# EAGLE design SpiCurrent-New (EAGLE 7.2.0)
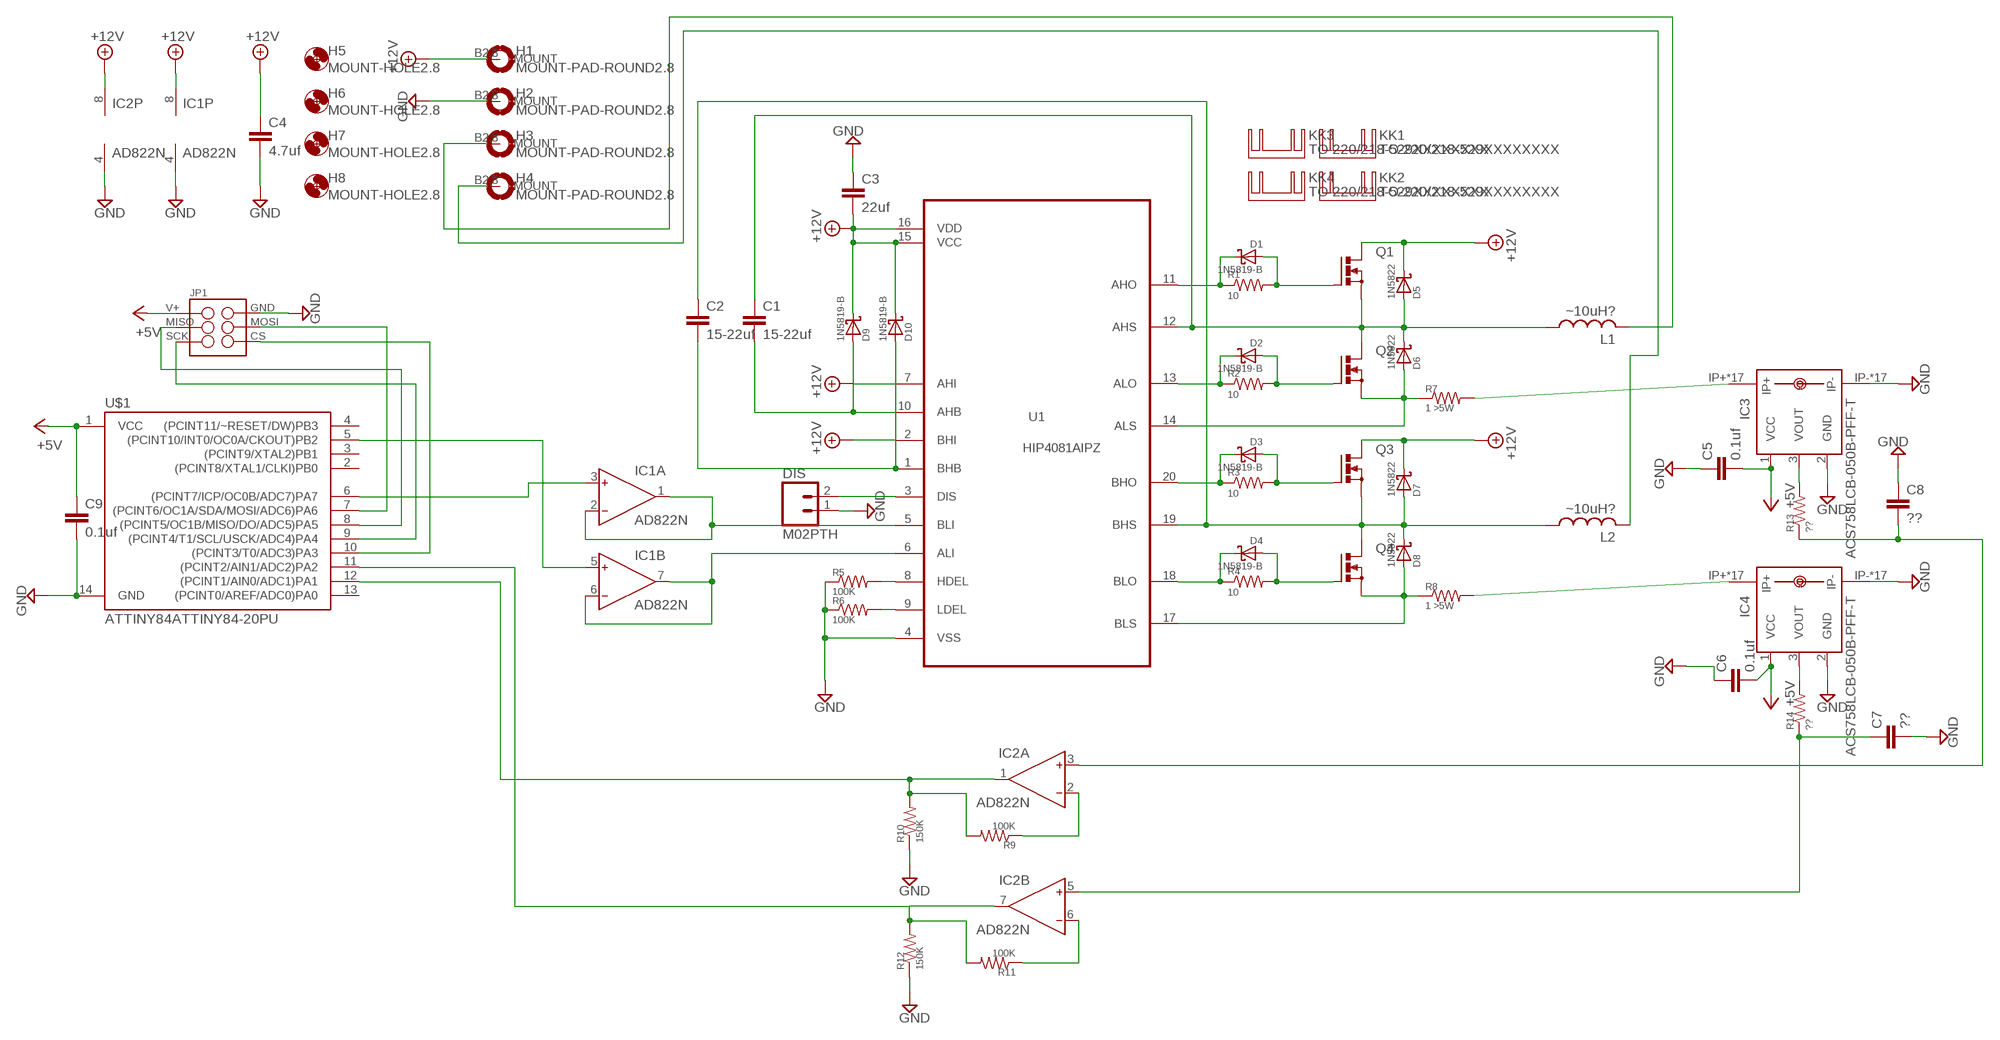
[diagram p0: schematic, sheet 1]

## Parts
C1  15-22uf  C-EU050-055X075  [C050-055X075]
C2  15-22uf  C-EU050-055X075  [C050-055X075]
C3  22uf  C-EU050-055X075  [C050-055X075]
C4  4.7uf  C-EU050-055X075  [C050-055X075]
C5  0.1uf  C-EU050-055X075  [C050-055X075]
C6  0.1uf  C-EU050-055X075  [C050-055X075]
C7  ??  C-EU050-055X075  [C050-055X075]
C8  ??  C-EU050-055X075  [C050-055X075]
C9  0.1uf  C-EU050-055X075  [C050-055X075]
D1  1N5819-B  [DO41-7.6]
D2  1N5819-B  [DO41-7.6]
D3  1N5819-B  [DO41-7.6]
D4  1N5819-B  [DO41-7.6]
D5  1N5822  1N5819-B  [DO41-7.6]
D6  1N5822  1N5819-B  [DO41-7.6]
D7  1N5822  1N5819-B  [DO41-7.6]
D8  1N5822  1N5819-B  [DO41-7.6]
D9  1N5819-B  [DO41-7.6]
D10  1N5819-B  [DO41-7.6]
DIS  M02PTH  [1X02]
H1  MOUNT-PAD-ROUND2.8  [2,8-PAD]
H2  MOUNT-PAD-ROUND2.8  [2,8-PAD]
H3  MOUNT-PAD-ROUND2.8  [2,8-PAD]
H4  MOUNT-PAD-ROUND2.8  [2,8-PAD]
H5  MOUNT-HOLE2.8  [2,8]
H6  MOUNT-HOLE2.8  [2,8]
H7  MOUNT-HOLE2.8  [2,8]
H8  MOUNT-HOLE2.8  [2,8]
IC1  AD822N  [DIL08]
IC2  AD822N  [DIL08]
IC3  ACS758LCB-050B-PFF-T  [CB-PFF]
IC4  ACS758LCB-050B-PFF-T  [CB-PFF]
JP1  M03X2SHROUD  [2X3-SPI-SHROUDED]
KK1  TO-220/218-529XXXXXXXX  [529XXXXXXXX]
KK2  TO-220/218-529XXXXXXXX  [529XXXXXXXX]
KK3  TO-220/218-529XXXXXXXX  [529XXXXXXXX]
KK4  TO-220/218-529XXXXXXXX  [529XXXXXXXX]
L1  ~10uH?  L-USTJ6-U2  [TJ6-U2]
L2  ~10uH?  L-USTJ6-U2  [TJ6-U2]
Q1  PMOSFET_NTO220BV  [TO220BV]
Q2  PMOSFET_NTO220BV  [TO220BV]
Q3  PMOSFET_NTO220BV  [TO220BV]
Q4  PMOSFET_NTO220BV  [TO220BV]
R1  10  R-US_0207/10  [0207/10]
R2  10  R-US_0207/10  [0207/10]
R3  10  R-US_0207/10  [0207/10]
R4  10  R-US_0207/10  [0207/10]
R5  100K  R-US_0207/10  [0207/10]
R6  100K  R-US_0207/10  [0207/10]
R7  1 >5W  R-US_VTA54  [VTA54]
R8  1 >5W  R-US_VTA54  [VTA54]
R9  100K  R-US_0207/10  [0207/10]
R10  150K  R-US_0207/10  [0207/10]
R11  100K  R-US_0207/10  [0207/10]
R12  150K  R-US_0207/10  [0207/10]
R13  ??  R-US_0207/10  [0207/10]
R14  ??  R-US_0207/10  [0207/10]
U1  HIP4081AIPZ  [DIP254P762X533-20]
U$1  ATTINY84ATTINY84-20PU  [DIL14]

## Nets
+5V: C5.2 C6.2 C9.1 IC3.1(VCC) IC4.1(VCC) JP1.1 U$1.1(VCC)
+12V: C3.2 C4.1 D5.C D7.C D9.C D10.C H1.B2,8(MOUNT) IC1.8(P:V+) IC2.8(P:V+) Q1.D Q3.D U1.2(BHI) U1.7(AHI) U1.15(VCC) U1.16(VDD)
GND: C3.1 C4.2 C5.1 C6.1 C7.2 C8.1 C9.2 DIS.1 H2.B2,8(MOUNT) IC1.4(P:V-) IC2.4(P:V-) IC3.2(GND) IC3.IP- IC3.IP-@2(IP-) IC3.IP-@3(IP-) IC3.IP-@4(IP-) IC3.IP-@5(IP-) IC3.IP-@6(IP-) IC3.IP-@7(IP-) IC3.IP-@8(IP-) IC3.IP-@9(IP-) IC3.IP-@10(IP-) IC3.IP-@11(IP-) IC3.IP-@12(IP-) IC3.IP-@13(IP-) IC3.IP-@14(IP-) IC3.IP-@15(IP-) IC3.IP-@16(IP-) IC3.IP-@17(IP-) IC4.2(GND) IC4.IP- IC4.IP-@2(IP-) IC4.IP-@3(IP-) IC4.IP-@4(IP-) IC4.IP-@5(IP-) IC4.IP-@6(IP-) IC4.IP-@7(IP-) IC4.IP-@8(IP-) IC4.IP-@9(IP-) IC4.IP-@10(IP-) IC4.IP-@11(IP-) IC4.IP-@12(IP-) IC4.IP-@13(IP-) IC4.IP-@14(IP-) IC4.IP-@15(IP-) IC4.IP-@16(IP-) IC4.IP-@17(IP-) JP1.2 R5.1 R6.1 R10.1 R12.1 U1.4(VSS) U$1.14(GND)
N$1: IC1.1(A:OUT) IC1.2(A:IN-) U1.5(BLI)
N$2: IC1.6(B:IN-) IC1.7(B:OUT) U1.6(ALI)
N$3: D3.C R3.1 U1.20(BHO)
N$4: D3.A Q3.G R3.2
N$5: D4.C R4.1 U1.18(BLO)
N$6: D4.A Q4.G R4.2
N$7: D2.C R2.1 U1.13(ALO)
N$8: D2.A Q2.G R2.2
N$9: D1.C R1.1 U1.11(AHO)
N$10: D1.A Q1.G R1.2
N$11: C1.1 D5.A D6.C L1.1 Q1.S Q2.D U1.12(AHS)
N$12: R5.2 U1.8(HDEL)
N$13: R6.2 U1.9(LDEL)
N$14: C2.1 D7.A D8.C L2.1 Q3.S Q4.D U1.19(BHS)
N$15: D6.A Q2.S R7.1 U1.14(ALS)
N$16: D8.A Q4.S R8.1 U1.17(BLS)
N$17: C1.2 D9.A U1.10(AHB)
N$18: C2.2 D10.A U1.1(BHB)
N$19: DIS.2 U1.3(DIS)
N$20: JP1.4 U$1.7((PCINT6/OC1A/SDA/MOSI/ADC6)PA6)
N$21: JP1.3 U$1.8((PCINT5/OC1B/MISO/DO/ADC5)PA5)
N$22: JP1.5 U$1.9((PCINT4/T1/SCL/USCK/ADC4)PA4)
N$23: JP1.6 U$1.10((PCINT3/T0/ADC3)PA3)
N$24: IC1.5(B:IN+) U$1.5((PCINT10/INT0/OC0A/CKOUT)PB2)
N$25: IC1.3(A:IN+) U$1.6((PCINT7/ICP/OC0B/ADC7)PA7)
N$26: IC2.2(A:IN-) R9.1
N$27: IC4.IP+ IC4.IP+@2(IP+) IC4.IP+@3(IP+) IC4.IP+@4(IP+) IC4.IP+@5(IP+) IC4.IP+@6(IP+) IC4.IP+@7(IP+) IC4.IP+@8(IP+) IC4.IP+@9(IP+) IC4.IP+@10(IP+) IC4.IP+@11(IP+) IC4.IP+@12(IP+) IC4.IP+@13(IP+) IC4.IP+@14(IP+) IC4.IP+@15(IP+) IC4.IP+@16(IP+) IC4.IP+@17(IP+) R8.2
N$28: IC2.1(A:OUT) R9.2 R10.2 U$1.12((PCINT1/AIN0/ADC1)PA1)
N$29: IC2.7(B:OUT) R11.2 R12.2 U$1.11((PCINT2/AIN1/ADC2)PA2)
N$30: IC2.6(B:IN-) R11.1
N$31: IC3.IP+ IC3.IP+@2(IP+) IC3.IP+@3(IP+) IC3.IP+@4(IP+) IC3.IP+@5(IP+) IC3.IP+@6(IP+) IC3.IP+@7(IP+) IC3.IP+@8(IP+) IC3.IP+@9(IP+) IC3.IP+@10(IP+) IC3.IP+@11(IP+) IC3.IP+@12(IP+) IC3.IP+@13(IP+) IC3.IP+@14(IP+) IC3.IP+@15(IP+) IC3.IP+@16(IP+) IC3.IP+@17(IP+) R7.2
N$32: C8.2 IC2.3(A:IN+) R13.1
N$33: C7.1 IC2.5(B:IN+) R14.1
N$34: IC3.3(VOUT) R13.2
N$35: IC4.3(VOUT) R14.2
N$36: H3.B2,8(MOUNT) L1.2
N$37: H4.B2,8(MOUNT) L2.2
Unconnected: U$1.2((PCINT8/XTAL1/CLKI)PB0) U$1.3((PCINT9/XTAL2)PB1) U$1.4((PCINT11/~RESET/DW)PB3) U$1.13((PCINT0/AREF/ADC0)PA0)

## Library data of the parts
C1-C9 = rcl:C-EU: CAPACITOR, European symbol
D1-D10 = diode-custom:1N581*: 1.0A SCHOTTKY BARRIER RECTIFIER Source: http://www.diodes.com/datasheets/ds23001.pdf
DIS = SparkFun-Connectors:M02: Standard 2-pin 0.1" header. Use with - straight break away headers ( PRT-00116) - right angle break away headers (PRT-00553) - swiss pins (PRT-00743) - machine pins (PRT-00117) - female headers (PRT-00115) Molex polarized connector foot print use with: PRT-08233 with associated crimp pins and housings. 2.54_SCREWTERM for use with PRT-10571. 3.5mm Screw Terminal footprints for PRT-08084 5mm Screw Terminal footprints for use with PRT-08432
H1-H4 = holes-custom:MOUNT-PAD-ROUND: MOUNTING PAD, round
H5-H8 = holes:MOUNT-HOLE: MOUNTING HOLE with drill center marker
IC1 IC2 = analog-devices:AD822: Single-Supply, Rail-to-Rail Low Power FET-Input Op Amp Source: http://www.analog.com/static/imported-files/data_sheets/AD822.pdf; OC_FARNELL: 1438581; OC_NEWARK: unknown
IC3 IC4 = allegro:ACS758*: Thermally Enhanced, Fully Integrated, Hall Effect-Based Linear Current Sensor with 100 micro Ohm Current Conductor display layer 49 Reference in BRD and place VIAs on circles Source: http://www.allegromicro.com/en/Products/Part_Numbers/0758/0758.pdf; MPN: ACS758LCB-050B-PFF-T; OC_FARNELL: 1718997; OC_NEWARK: 04R7131
JP1 = CustomParts:M03X2: 2x3 .1" header. Shrouded, with keying- CONN-10681 SMT- CONN-11415 Pogo pins- HW-11044; PROD_ID: CONN-10681
KK1-KK4 = heatsink-aavid:TO-220/218: HEATSINKS TO-220/218
L1 L2 = rcl:L-US: INDUCTOR, American symbol
Q1-Q4 = transistor-power:PMOSFET_N: Power MOSFET N-Channel
R1-R4 = resistor:R-US_: RESISTOR, American symbol
R5-R14 = resistor-custom:R-US_: RESISTOR, American symbol
U1 = Intersil_By_element14_Batch_1:HIP4081AIPZ: Bridge FET Driver; MPN: HIP4081AIPZ; OC_FARNELL: 9664130; OC_NEWARK: 57K3817; PACKAGE: DIP-20; SUPPLIER: INTERSIL
U$1 = SparkFun-DigitalIC:ATTINY84: Atmel 14-pin 2/4/8kB flash uC

## Board
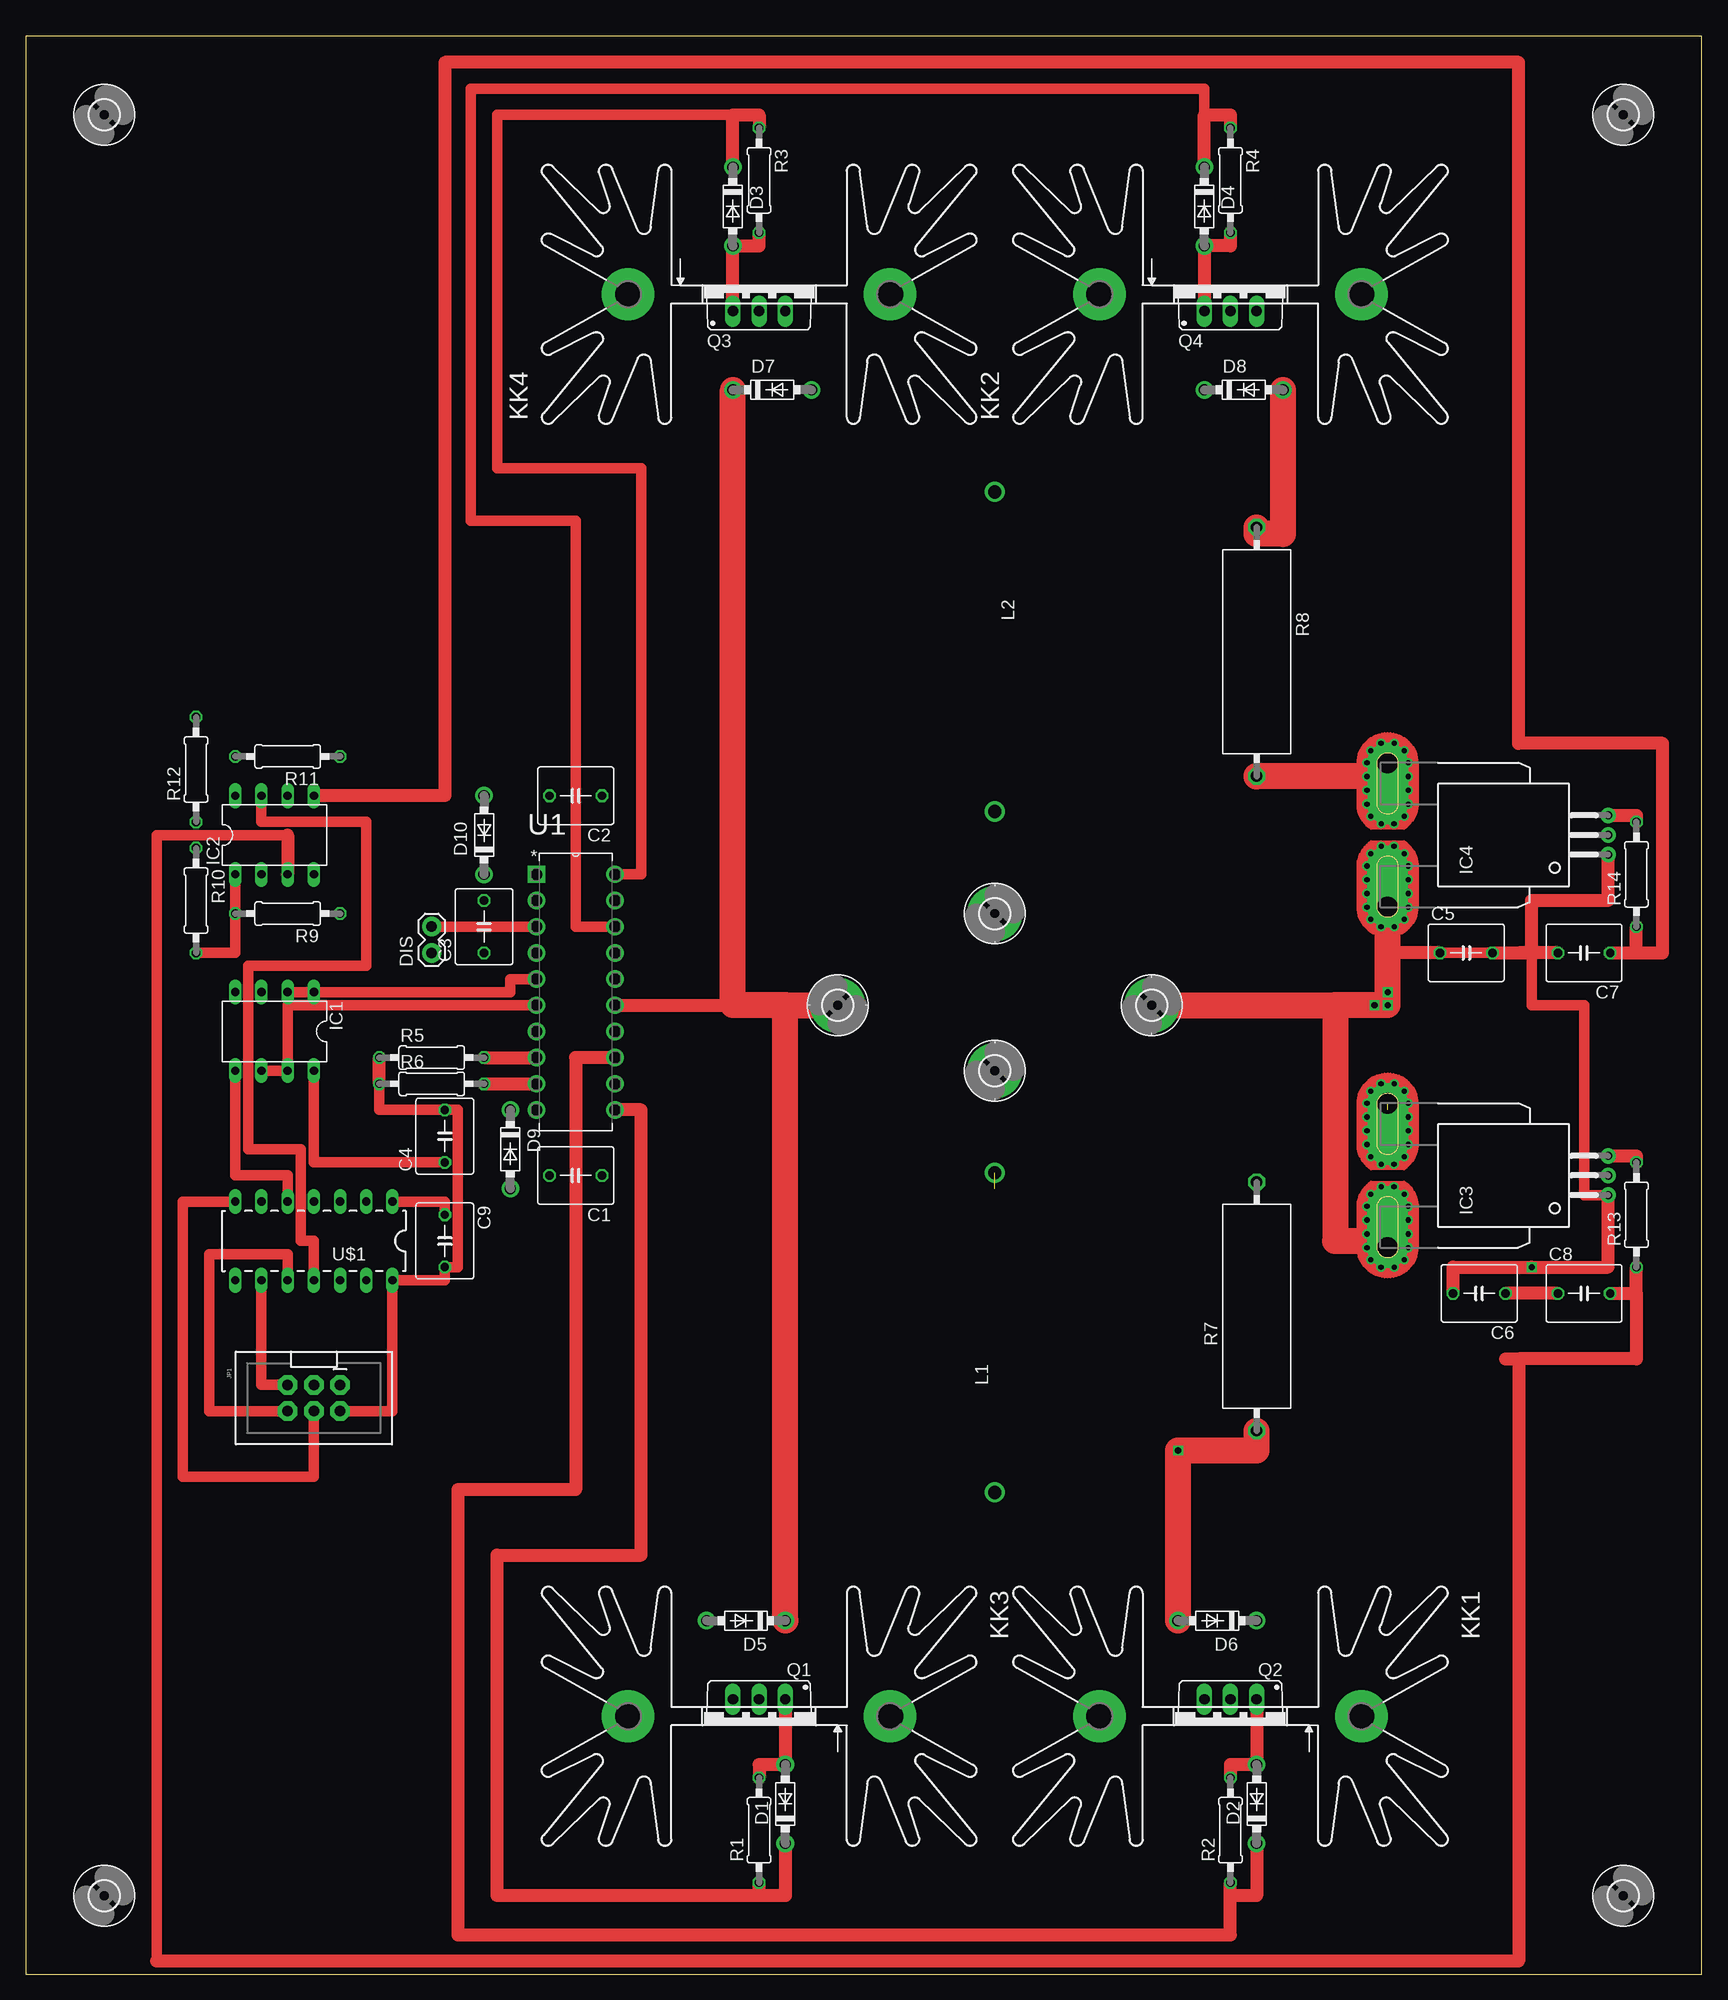
[diagram p1: board, top side]
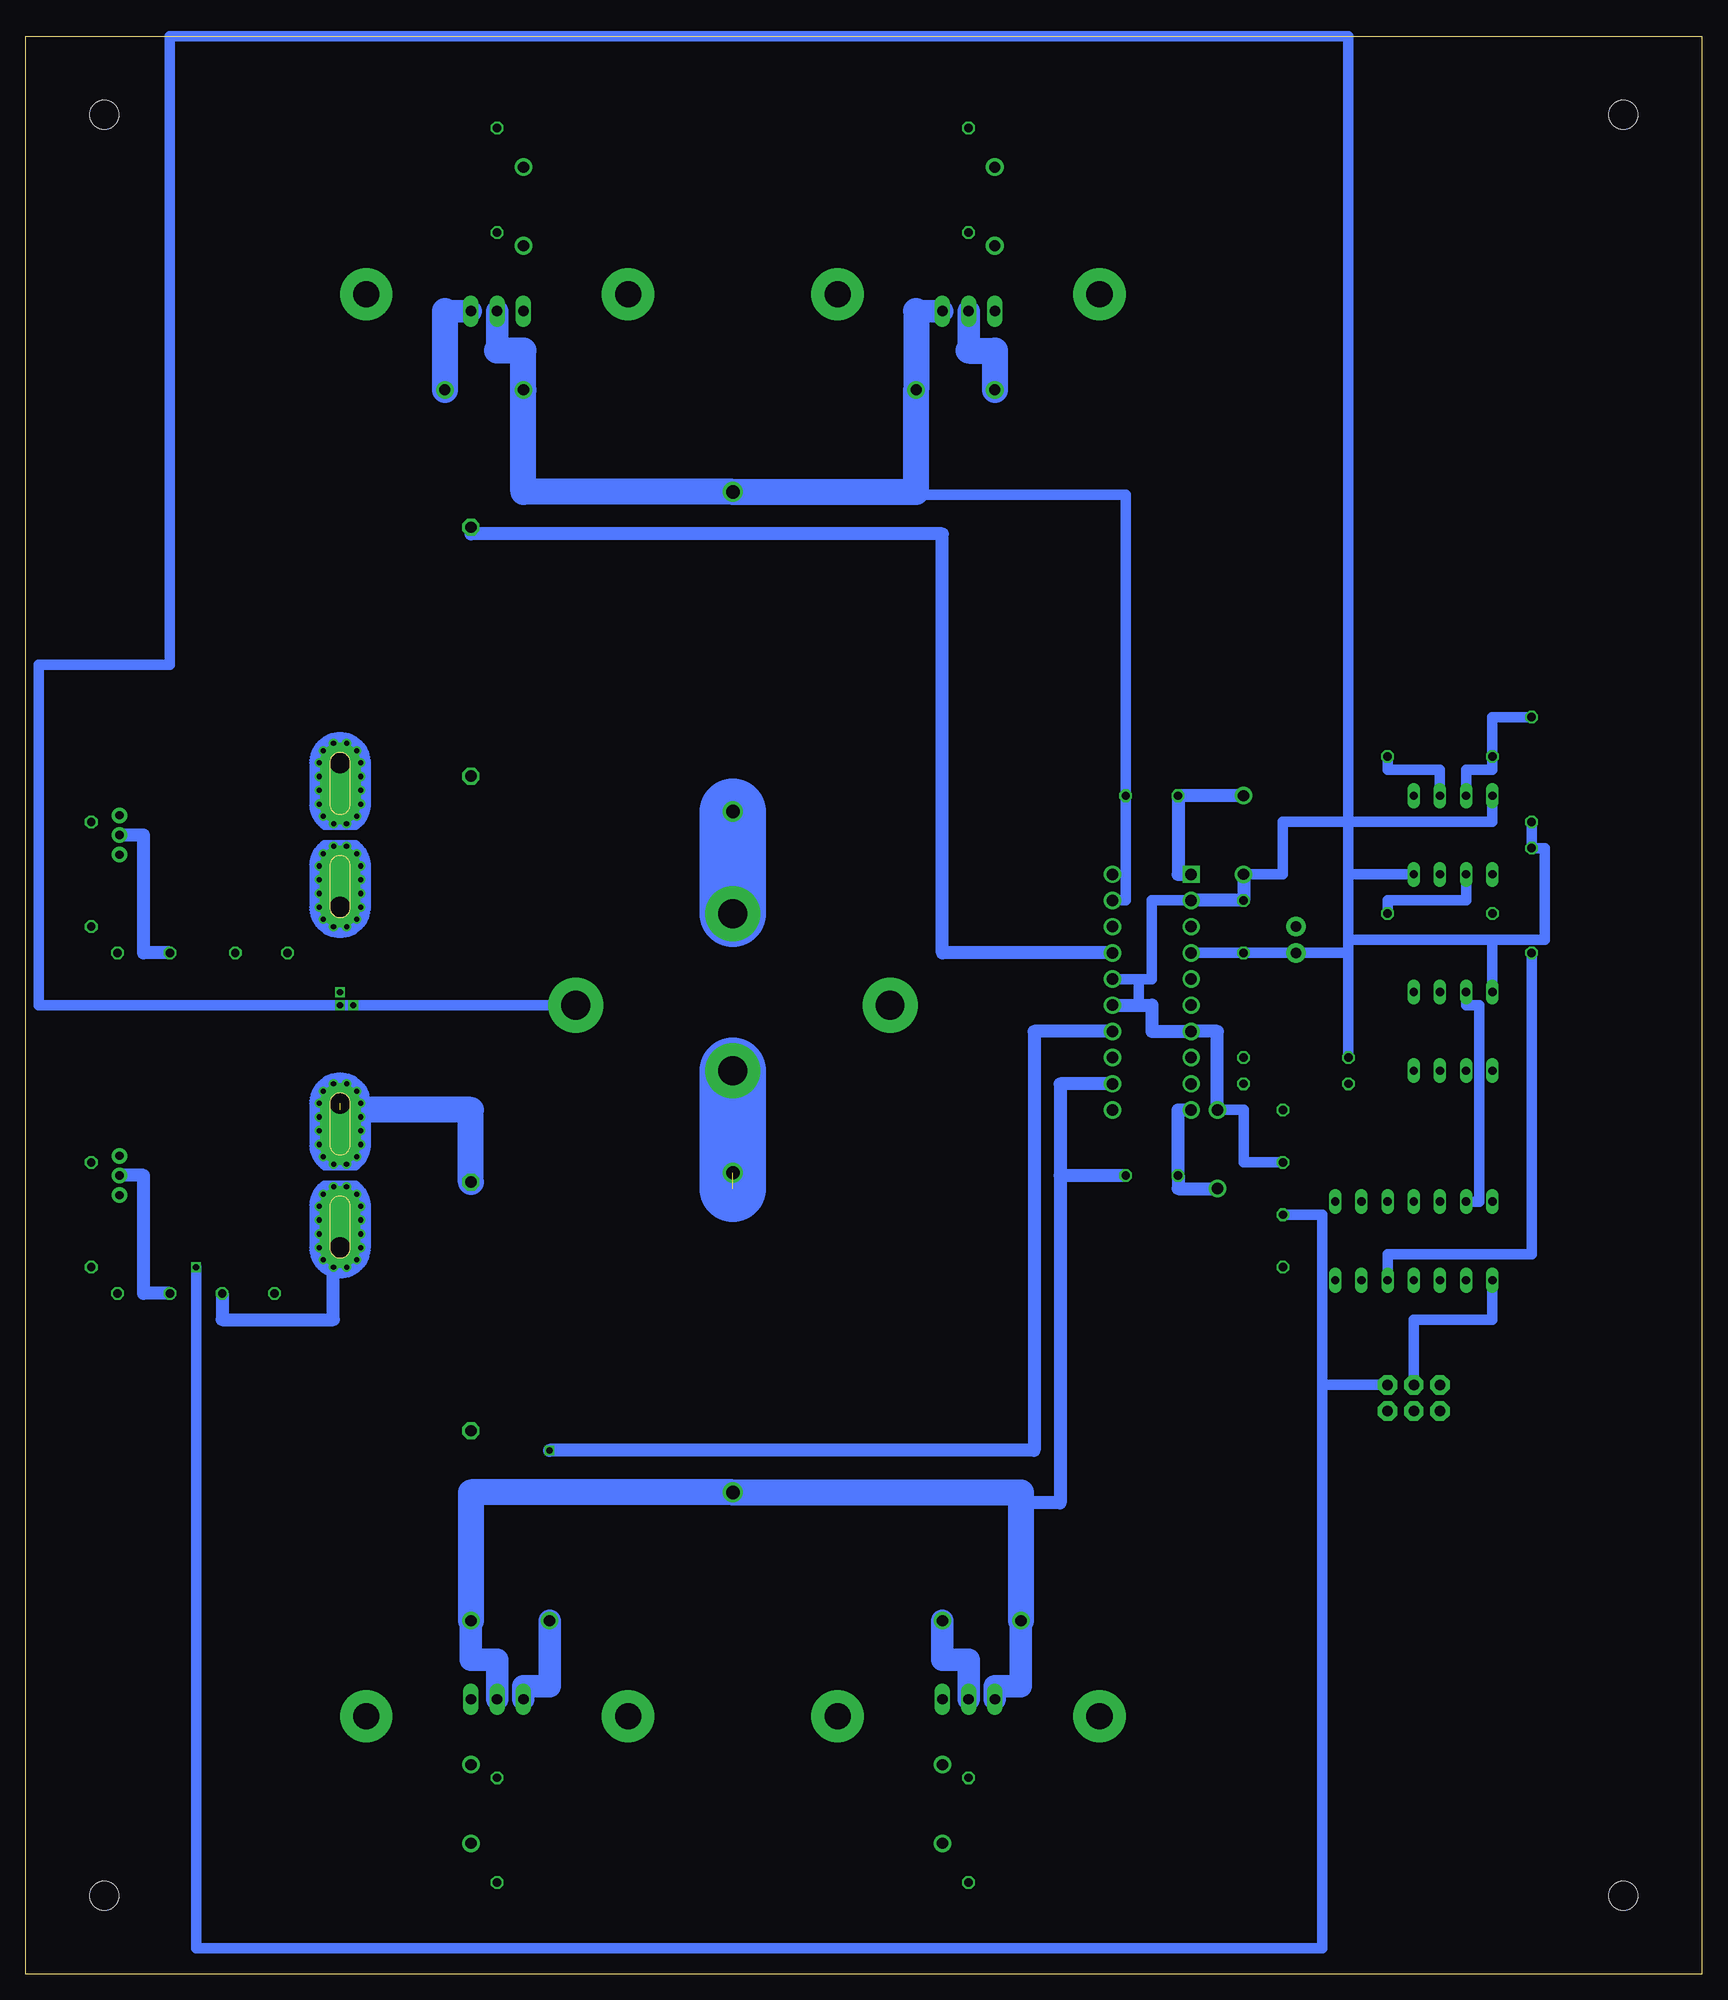
[diagram p2: board, bottom side, seen from below]

Size 162.56 x 187.96 mm. Coordinates in mm from the lower left corner, seen from the top.
Outline: 0,0 162.56,0 162.56,187.96 0,187.96 0,0
Copper layers (1*16): Top 0.0356mm / dielectric 1.5011mm / Bottom 0.0356mm
Design rules "LaenPCBOrder-bigtesting": minimum track width 10mil, minimum drill 13mil, track to track 10mil, track to pad 10mil, pad to pad 10mil, via to via 10mil, smd to smd 10mil, copper to edge 15mil, drill to drill 6mil, minimum pad ring 7mil, minimum via ring 7mil, stop-mask expansion 3mil, vias tented up to drill 0mil, thermal gap 20mil

### Footprints (pad centres in the part's own frame; a part is rotated, then mirrored left to right if it is on the bottom)
C050-055X075 = drill 0.813 octagon: 1 -2.54,0; 2 2.54,0
DO41-7.6 = drill 1.1 pad 1.7: A 3.81,0; C -3.81,0
1X02 = drill 1.016 pad 1.88: 1 0,0; 2 2.54,0
2,8-PAD = drill 2.8 pad 5.334: B2,8 0,0
2,8 = hole 2.8: 0,0
DIL08 = drill 0.813 long: 1 -3.81,-3.81; 2 -1.27,-3.81; 3 1.27,-3.81; 4 3.81,-3.81; 5 3.81,3.81; 6 1.27,3.81; 7 -1.27,3.81; 8 -3.81,3.81
CB-PFF = drill 0.8 pad 1.5: 1 -1.91,-21.4; 2 0,-21.4; 3 1.91,-21.4 | drill 2 pad 4 offset: IP+ 7,0; IP- -7,0 | drill 0.5 pad 0.9: IP+@2 8.89,0.635; IP+@3 8.89,-0.635; IP+@4 8.175,-1.625; IP+@5 7,-2; IP+@6 5.675,-2; IP+@7 4.35,-2; IP+@8 3,-2; IP+@9 1.825,-1.625; IP+@10 1.1,-0.625; IP+@11 1.1,0.625; IP+@12 1.825,1.625; IP+@13 3,2; IP+@14 4.35,2; IP+@15 5.675,2; IP+@16 7,2; IP+@17 8.175,1.625; IP-@2 -8.89,0.635; IP-@3 -8.89,-0.635; IP-@4 -8.175,-1.625; IP-@5 -7,-2; IP-@6 -5.675,-2; IP-@7 -4.325,-2; IP-@8 -3,-2; IP-@9 -1.825,-1.625; IP-@10 -1.1,-0.625; IP-@11 -1.1,0.625; IP-@12 -1.825,1.625; IP-@13 -3,2; IP-@14 -4.325,2; IP-@15 -5.675,2; IP-@16 -7,2; IP-@17 -8.175,1.625
2X3-SPI-SHROUDED = drill 1.016 pad 1.88 octagon: 1 -1.27,2.54; 2 1.27,2.54; 3 -1.27,0; 4 1.27,0; 5 -1.27,-2.54; 6 1.27,-2.54
529XXXXXXXX = drill 2.54 pad 5.08: A2,5 -12.7,-0.889; B2,5 12.7,-0.889
TJ6-U2 = drill 1.3: 1 -15.5,0; 2 15.5,0
TO220BV = drill 1.016 long: D 0,-2.54; G -2.54,-2.54; S 2.54,-2.54
0207/10 = drill 0.813 octagon: 1 -5.08,0; 2 5.08,0
VTA54 = drill 1.1 octagon: 1 -12.065,0; 2 12.065,0
DIP254P762X533-20 = drill 1.118 square: 1 -7.62,22.86 | drill 1.118: 2 -7.62,20.32; 3 -7.62,17.78; 4 -7.62,15.24; 5 -7.62,12.7; 6 -7.62,10.16; 7 -7.62,7.62; 8 -7.62,5.08; 9 -7.62,2.54; 10 -7.62,0; 11 0,0; 12 0,2.54; 13 0,5.08; 14 0,7.62; 15 0,10.16; 16 0,12.7; 17 0,15.24; 18 0,17.78; 19 0,20.32; 20 0,22.86
DIL14 = drill 0.813 long: 1 -8.89,-3.81; 2 -6.35,-3.81; 3 -3.81,-3.81; 4 -1.27,-3.81; 5 1.27,-3.81; 6 3.81,-3.81; 7 6.35,-3.81; 8 6.35,3.81; 9 3.81,3.81; 10 1.27,3.81; 11 -1.27,3.81; 12 -3.81,3.81; 13 -6.35,3.81; 14 -8.89,3.81

### Placement (x,y rotation side)
C1  53.34,77.47 180 top
C2  53.34,114.3 180 top
C3  44.45,101.6 90 top
C4  40.64,81.28 90 top
C5  139.7,99.06 0 top
C6  140.97,66.04 180 top
C7  151.13,99.06 180 top
C8  151.13,66.04 0 top
C9  40.64,71.12 270 top
D1  73.66,16.51 90 top
D2  119.38,16.51 90 top
D3  68.58,171.45 270 top
D4  114.3,171.45 270 top
D5  69.85,34.29 180 top
D6  115.57,34.29 180 top
D7  72.39,153.67 0 top
D8  118.11,153.67 0 top
D9  46.99,80.01 270 top
D10  44.45,110.49 90 top
DIS  39.37,99.06 90 top
H1  78.74,93.98 270 top
H2  109.22,93.98 180 top
H3  93.98,87.63 0 top
H4  93.98,102.87 0 top
H5  7.62,7.62 0 top
H6  154.94,180.34 0 top
H7  154.94,7.62 0 top
H8  7.62,180.34 0 top
IC1  24.13,91.44 180 top
IC2  24.13,110.49 0 top
IC3  132.08,77.47 90 top
IC4  132.08,110.49 90 top
JP1  27.94,55.88 270 top
KK1  116.84,24.13 180 top
KK2  116.84,163.83 0 top
KK3  71.12,24.13 180 top
KK4  71.12,163.83 0 top
L1  93.98,62.23 90 top
L2  93.98,128.27 270 top
Q1  71.12,24.13 180 top
Q2  116.84,24.13 180 top
Q3  71.12,163.83 0 top
Q4  116.84,163.83 0 top
R1  71.12,13.97 90 top
R2  116.84,13.97 90 top
R3  71.12,173.99 270 top
R4  116.84,173.99 270 top
R5  39.37,88.9 0 top
R6  39.37,86.36 0 top
R7  119.38,64.77 90 top
R8  119.38,128.27 270 top
R9  25.4,102.87 180 top
R10  16.51,104.14 270 top
R11  25.4,118.11 180 top
R12  16.51,116.84 90 top
R13  156.21,73.66 90 top
R14  156.21,106.68 90 top
U1  57.15,83.82 0 top
U$1  26.67,71.12 180 top

### Tracks (layer width: path | path; a pad name or v marks a point on that pad's centre or on a via)
+5V  (via drill 0.6)
  Top 1.016: C9.1 40.64,74.93 U$1.1 | IC3.1 151.13,75.56 151.13,93.98 146.05,93.98 146.05,99.06
  Top 1.27: C5.2 146.05,99.06 146.05,104.14 153.48,104.14 IC4.1 | C6.2 138.43,68.58 v146.05,68.58 153.48,68.58 IC3.1
  Bottom 1.016: v146.05,68.58 146.05,2.54 36.83,2.54 36.83,57.15 | 36.83,57.15 JP1.1 | 36.83,57.15 36.83,73.66 C9.1
+12V
  Top 1.016: C4.1 27.94,78.74 IC1.8
  Top 1.27: U1.15 68.58,93.98
  Top 2.54: D5.C 73.66,93.98 | 73.66,93.98 H1.B2,8 | 73.66,93.98 68.58,93.98 D7.C
  Bottom 1.016: C4.1 44.45,78.74 44.45,83.82 D9.C | U1.2 53.34,104.14 53.34,96.52 U1.16 54.61,96.52 54.61,93.98 | IC2.8 20.32,111.76 40.64,111.76 40.64,106.68 D10.C
  Bottom 1.27: U1.15 54.61,93.98 53.34,93.98 53.34,91.44 U1.7 46.99,91.44 D9.C | U1.2 C3.2 D10.C
  Bottom 2.184: Q3.D 71.12,157.48 | Q1.D 71.12,30.48 73.66,30.48 D5.C
  Bottom 2.54: 71.12,157.48 68.58,157.48 D7.C
GND  (via drill 0.6)
  Top 1.016: R6.1 34.29,83.82 C4.2 41.91,83.82 41.91,68.58 C9.2 40.64,67.31 U$1.14 35.56,54.61 JP1.2 | C5.1 144.78,99.06
  Top 1.27: C5.1 132.08,99.06 | C7.2 144.78,99.06 | C8.1 C6.1 | R6.1 R5.1
  Top 2.54: H2.B2,8 127,93.98 | IC4.IP- 132.08,99.06 v132.08,95.25 v132.08,93.98 v130.81,93.98 127,93.98 | 127,93.98 127,71.12 132.08,71.12 IC3.IP-
  Bottom 1.016: R5.1 34.29,99.06 | 34.29,99.06 DIS.1 C3.1 U1.4 | H2.B2,8 161.29,93.98 161.29,127 148.59,127 148.59,187.96 34.29,187.96 34.29,106.68 | 34.29,106.68 34.29,100.33 | 34.29,100.33 34.29,99.06 | IC2.4 34.29,106.68 | R12.1 R10.1 15.24,109.22 15.24,100.33 20.32,100.33 | IC1.4 20.32,100.33 | 20.32,100.33 34.29,100.33
  Bottom 1.27: C7.2 151.13,99.06 151.13,110.49 IC4.2 | C8.1 151.13,66.04 151.13,77.47 IC3.2 | C6.1 143.51,63.5 132.72,63.5 IC3.IP-@3
N$1
  Top 1.016: IC1.2 IC1.1 46.99,95.25 46.99,96.52 U1.5
N$2
  Top 1.016: U1.6 25.4,93.98 IC1.7 IC1.6
N$3
  Top 1.016: U1.20 59.69,106.68 59.69,146.05 45.72,146.05 45.72,180.34 68.58,180.34
  Top 1.27: D3.C 68.58,180.34 71.12,180.34 R3.1
N$4
  Top 1.27: Q3.G D3.A 71.12,167.64 R3.2
N$5
  Top 1.016: U1.18 53.34,101.6 53.34,140.97 43.18,140.97 43.18,182.88 114.3,182.88 114.3,180.34
  Top 1.27: D4.C 114.3,180.34 116.84,180.34 R4.1
N$6
  Top 1.27: Q4.G D4.A 116.84,167.64 R4.2
N$7
  Top 1.27: D2.C 119.38,7.62 116.84,7.62 R2.1 116.84,3.81 41.91,3.81 41.91,46.99 53.34,46.99 53.34,88.9 U1.13
N$8
  Top 1.27: Q2.G D2.A 116.84,20.32 R2.2
N$9
  Top 1.27: 71.12,7.62 73.66,7.62 D1.C | 71.12,7.62 R1.1 | 71.12,7.62 45.72,7.62 45.72,40.64 59.69,40.64 59.69,83.82 U1.11
N$10
  Top 1.27: Q1.G D1.A 71.12,20.32 R1.2
N$11
  Bottom 1.27: U1.12 62.23,86.36 62.23,77.47 | 62.23,77.47 C1.1 | 62.23,77.47 62.23,45.72 66.04,45.72
  Bottom 2.184: D5.A 66.04,27.94 68.58,27.94 Q1.S | Q2.D 116.84,30.48 119.38,30.48 D6.C
  Bottom 2.54: D6.C 119.38,46.73 L1.1 66.04,46.73 66.04,45.72 D5.A
N$12
  Top 1.27: R5.2 U1.8
N$13
  Top 1.27: R6.2 U1.9
N$14
  Bottom 1.016: U1.19 55.88,104.14 C2.1 55.88,143.51 76.2,143.51 76.2,143.77
  Bottom 2.184: 116.84,157.48 Q4.D | Q3.S 76.2,161.29
  Bottom 2.54: 116.84,157.48 114.3,157.48 D8.C 114.3,143.77 L2.1 76.2,143.77 D7.A 76.2,161.29
N$15  (via drill 0.6)
  Top 2.54: D6.A v111.76,50.8 119.38,50.8 R7.1
  Bottom 1.27: U1.14 64.77,91.44 64.77,50.8 v111.76,50.8
  Bottom 2.184: Q2.S 114.3,27.94 111.76,27.94 D6.A
N$16  (1 unrouted)
  Top 2.54: D8.A 121.92,139.7 119.38,139.7 R8.1
  Bottom 1.27: U1.17 73.66,99.06 73.66,139.7 119.38,139.7
  Bottom 2.184: Q4.S 121.92,161.29
  Bottom 2.54: 121.92,161.29 D8.A
N$17
  Bottom 1.27: U1.10 50.8,83.82 C1.2 50.8,76.2 D9.A
N$18
  Bottom 1.27: U1.1 50.8,106.68 C2.2 D10.A
N$19
  Top 1.016: DIS.2 U1.3
N$20
  Top 1.016: JP1.4 27.94,48.26 15.24,48.26 15.24,74.93 U$1.7
N$21
  Bottom 1.016: JP1.3 27.94,63.5 20.32,63.5 U$1.8
N$22
  Top 1.016: JP1.5 22.86,57.15 U$1.9
N$23
  Top 1.016: JP1.6 17.78,54.61 17.78,69.85 25.4,69.85 U$1.10
N$24
  Top 1.016: U$1.5 25.4,77.47 20.32,77.47 IC1.5
N$25
  Bottom 1.016: U$1.6 21.59,74.93 21.59,93.98 22.86,93.98 IC1.3
N$26
  Bottom 1.016: IC2.2 22.86,104.14 30.48,104.14 R9.1
N$27
  Top 2.54: IC4.IP+@15 119.38,116.16 R8.2
N$28
  Top 1.016: IC2.1 R9.2 20.32,99.06 R10.2
  Bottom 1.016: U$1.12 30.48,69.85 16.51,69.85 R10.2
N$29
  Top 1.016: U$1.11 27.94,71.12 26.67,71.12 26.67,80.01 21.59,80.01 21.59,97.79 33.02,97.79 33.02,111.76 22.86,111.76 IC2.7
  Bottom 1.016: R12.2 20.32,121.92 R11.2 20.32,116.84 22.86,116.84 IC2.7
N$30
  Bottom 1.016: IC2.6 25.4,116.84 30.48,116.84 R11.1
N$31  (1 unrouted)
  Bottom 2.54: R7.2 119.38,83.82 132.08,83.82
N$32
  Top 1.016: 12.7,1.27 12.7,110.49 25.4,110.49
  Top 1.27: 156.21,66.04 R13.1 | C8.2 156.21,66.04 | 156.21,66.04 156.21,59.69 144.78,59.69 | 143.51,59.69 144.78,59.69 | 144.78,59.69 144.78,1.27 12.7,1.27 | 25.4,110.49 IC2.3
N$33
  Top 1.27: R14.1 156.21,99.06 C7.1 158.75,99.06 158.75,119.38 144.78,119.38 144.78,185.42 40.64,185.42 40.64,114.3 IC2.5
N$34
  Top 1.27: IC3.3 156.21,79.38 R13.2
N$35
  Top 1.27: IC4.3 156.21,112.4 R14.2
N$36  (1 unrouted)
  Bottom 6.452: H3.B2,8 93.98,76.2
N$37
  Bottom 6.452: L2.2 H4.B2,8